# Altium schematic sheet Type-C_Connector_and_PD_Switch.SchDoc: Type-C Connector & PD Switch
size 292 x 193 mm; SheetNumber: 4; SheetTotal: 12; SheetSize: A4
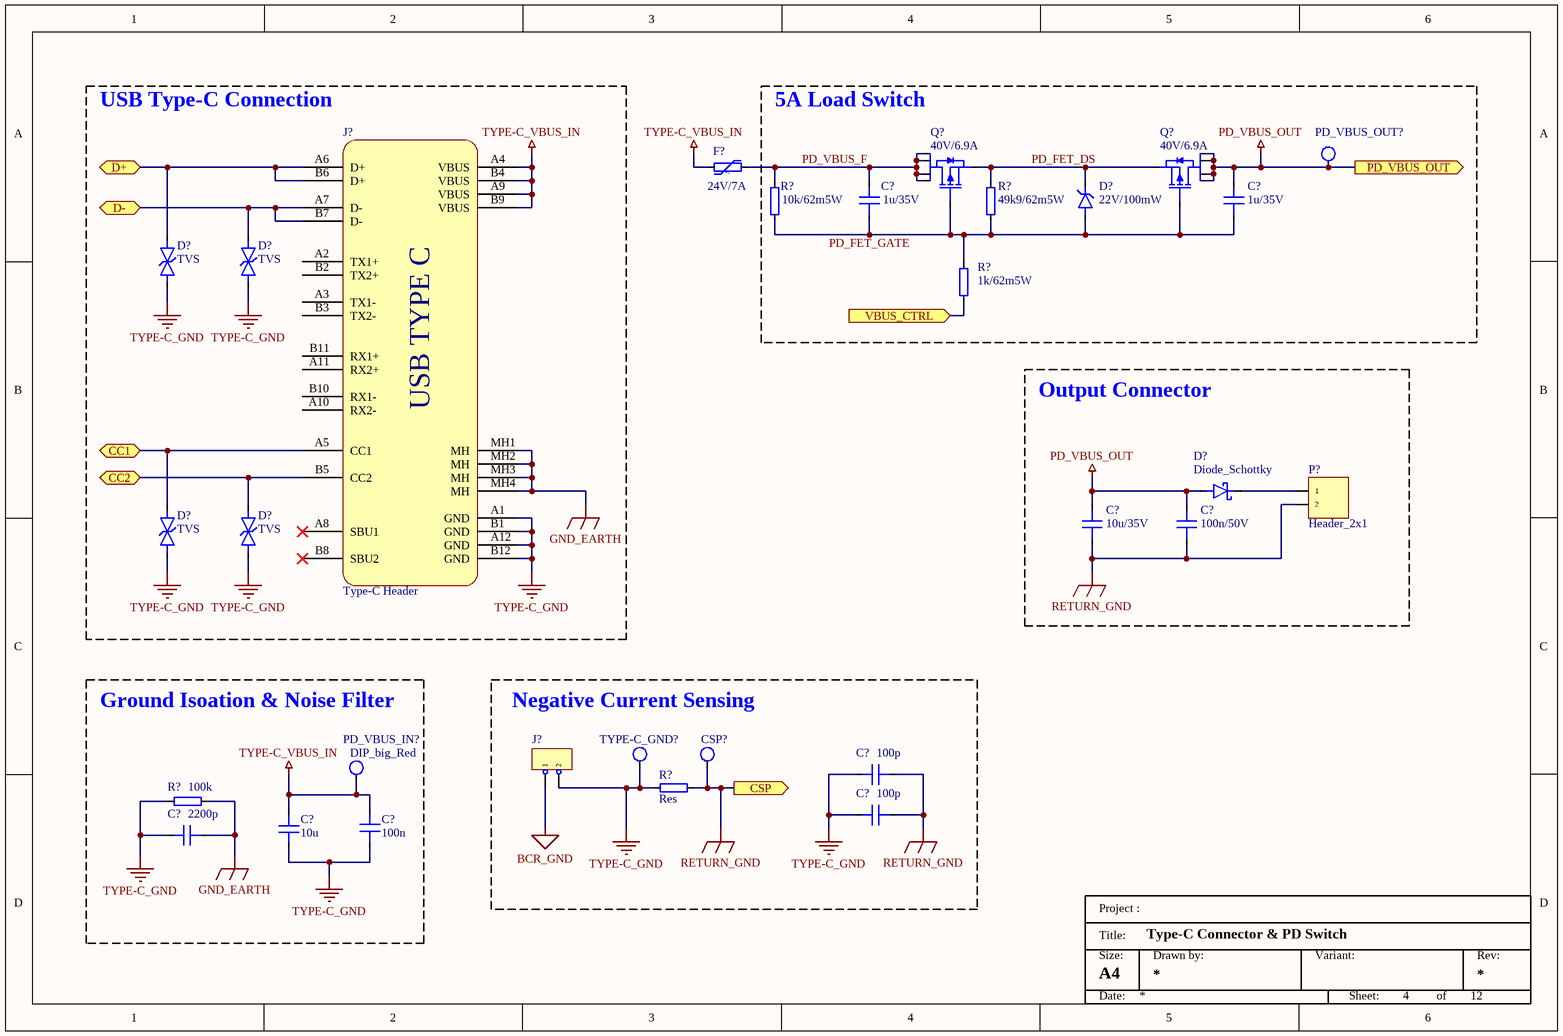
[diagram p0: Type-C_Connector_and_PD_Switch.SchDoc]

## Parts
(Parts that share a designator on the sheet are numbered #1, #2 ... from top to bottom, then left to right.)
C?#1  1u/35V  [0805_Cap]
C?#2  1u/35V  [0805_Cap]
C?#3  10u/35V  [0805_Cap]
C?#4  100n/50V  [0402_CAP]
C?#5  100p  [0805_Cap]
C?#6  100p  [0805_Cap]
C?#7  100n  [0805_Cap]
C?#8  2200p  [0805_Cap]
C?#9  10u  [0805_Cap]
CSP?  SMD_25mil  [TestPoint_smd_25mil]  (value not drawn)
D?#1  22V/100mW  [SOD-923-2]
D?#2  TVS  [SOD-523]
D?#3  TVS  [SOD-523]
D?#4  Diode_Schottky
D?#5  TVS  [SOD-523]
D?#6  TVS  [SOD-523]
F?  24V/7A  [2920_PTC]
J?#1  Type-C Header
J?#2  Jumper_2x1  [Dupont_Header_(Female)_2.54_2x1]  (value not drawn)
P?  Header_2x1  [XT60PW-M]
PD_VBUS_IN?  DIP_big_Red  [TestPoint_dip_big]
PD_VBUS_OUT?  DIP_big_Red  [TestPoint_dip_big]  (value not drawn)
Q?#1  40V/6.9A  [TSOP-6]
Q?#2  40V/6.9A  [TSOP-6]
R?#1  10k/62m5W  [0402_Res]
R?#2  49k9/62m5W  [0402_Res]
R?#3  1k/62m5W  [0402_Res]
R?#4  Res  [0603_Res]
R?#5  100k  [0603_Res]
TYPE-C_GND?  SMD_25mil  [TestPoint_smd_25mil]  (value not drawn)

## Blocks framed on the sheet
USB Type-C Connection: D?#2 D?#3 D?#5 D?#6 J?#1
5A Load Switch: C?#1 C?#2 D?#1 PD_VBUS_OUT? Q?#1 Q?#2 R?#1-R?#3
Output Connector: C?#3 C?#4 D?#4 P?
Ground Isoation & Noise Filter: C?#7-C?#9 PD_VBUS_IN? R?#5
Negative Current Sensing: C?#5 C?#6 CSP? J?#2 R?#4 TYPE-C_GND?

## Ports
CC1 (bidir), CC2 (bidir), CSP (out), D+ (bidir), D- (bidir), PD_VBUS_OUT (out), VBUS_CTRL (in)

## Nets
BCR_GND: J?#2.1
GND_EARTH: C?#8.2 J?#1.MH1(MH) J?#1.MH2(MH) J?#1.MH3(MH) J?#1.MH4(MH) R?#5.2
PD_VBUS_OUT: C?#2.1 C?#3.1 C?#4.1 D?#4.1(A) PD_VBUS_OUT?.1 Q?#2.1(D1_1) Q?#2.2(D1_2) Q?#2.5(D1_3) Q?#2.6(D1_4) ; port PD_VBUS_OUT
RETURN_GND: C?#3.2 C?#4.2 C?#5.2 C?#6.2 CSP?.1 P?.2 R?#4.2 ; port CSP
TYPE-C_GND: C?#5.1 C?#6.1 C?#7.2 C?#8.1 C?#9.1 D?#2.2(K) D?#3.1(A) D?#5.2(K) D?#6.2(K) J?#1.A1(GND) J?#1.A12(GND) J?#1.B1(GND) J?#1.B12(GND) J?#2.2 R?#4.1 R?#5.1 TYPE-C_GND?.1
TYPE-C_VBUS_IN: C?#7.1 C?#9.2 F?.1 J?#1.A4(VBUS) J?#1.A9(VBUS) J?#1.B4(VBUS) J?#1.B9(VBUS) PD_VBUS_IN?.1
CC1: D?#5.1(A) J?#1.A5(CC1) ; port CC1
CC2: D?#6.1(A) J?#1.B5(CC2) ; port CC2
D+: D?#2.1(A) J?#1.A6(D+) J?#1.B6(D+) ; port D+
D-: D?#3.2(K) J?#1.A7(D-) J?#1.B7(D-) ; port D-
PD_FET_DS: D?#1.2(K) Q?#1.4(S1) Q?#2.4(S1) R?#2.2
PD_FET_GATE: C?#1.2 C?#2.2 D?#1.1(A) Q?#1.3(G1) Q?#2.3(G1) R?#1.2 R?#2.1 R?#3.2
PD_VBUS_F: C?#1.1 F?.2 Q?#1.1(D1_1) Q?#1.2(D1_2) Q?#1.5(D1_3) Q?#1.6(D1_4) R?#1.1
VBUS_CTRL: R?#3.1 ; port VBUS_CTRL
NetD?#4_2: D?#4.2(K) P?.1

Not connected (* = marked no-connect by the designer): J?#1 A2(TX1+) A3(TX1-) A8(SBU1)* A10(RX2-) A11(RX2+) B2(TX2+) B3(TX2-) B8(SBU2)* B10(RX1-) B11(RX1+)

## Notes on the sheet
- Project :
- Size:
- Title:
- Drawn by:
- Variant:
- Rev:
- Date:
- Sheet:
- of
- (in symbol PTC) +t°
- (in symbol Type-C_20_Female) USB TYPE C

## Library data of the parts
C?#1 C?#2 = Cap: 25V 1uF Y5V ±20% 0805  Multilayer Ceramic Capacitors MLCC - SMD/SMT ROHS; Mfr. #: 0805F105M250NT; Mfr.: FH (Guangdong Fenghua Advanced Tech); Datasheet: https://datasheet.lcsc.com/lcsc/1810311214_FH--Guangdong-Fenghua-Advanced-Tech-0805F105M250NT_C89378.pdf; Distributor_Link: https://jlcpcb.com/partdetail/90558-0805F105M250NT/C89378; Distributor #: C89378
C?#3 = Cap: 25V 10uF X5R - Multilayer Ceramic Capacitors MLCC - SMD/SMT ROHS; Mfr. #: GRM21BR61E106KA73K; Mfr.: Murata Electronics; Datasheet: https://jlcpcb.com/parts/2nd/Capacitors/Multilayer_Ceramic_Capacitors_MLCC_SMD_SMT_33; Distributor_Link: https://jlcpcb.com/partdetail/4477883-GRM21BR61E106KA73K/C3909351; Distributor #: C3909351
C?#4 = Cap: 16V 100nF -20%~+80% 0402  Multilayer Ceramic Capacitors MLCC - SMD/SMT ROHS; Mfr. #: 0402F104Z160NT; Mfr.: FH (Guangdong Fenghua Advanced Tech); Datasheet: https://datasheet.lcsc.com/lcsc/2202131930_FH--Guangdong-Fenghua-Advanced-Tech-0402F104Z160NT_C2838746.pdf; Distributor_Link: https://jlcpcb.com/partdetail/3013916-0402F104Z160NT/C2838746; Distributor #: C2838746
C?#5-C?#9 = Cap: General capacitor (non-polarized); Mfr. #: *; Mfr.: *; Distributor_Link: *; Datasheet: *; Distributor #: *
CSP? PD_VBUS_IN? PD_VBUS_OUT? TYPE-C_GND? = Test_Point: General test point; Mfr. #: N/A; Mfr.: N/A; Distributor_Link: N/A; Datasheet: N/A; Distributor #: N/A
D?#1 = Diode_Zener: Zener Diodes CDZV22B is the 100mW type compact (1006 size) diode for voltage regulation.; Mfr. #: CDZVT2R22B; Mfr.: ROHM Semiconductor; Distributor_Link: https://www.mouser.tw/ProductDetail/ROHM-Semiconductor/CDZVT2R22B?qs=4v%252BiZTmLVHG6BDwFzUsoYg%3D%3D; Datasheet: https://www.rohm.com/datasheet?p=CDZV22B&dist=Mouser&media=referral&source=mouser.com&campaign=Mouser; Distributor #: 755-CDZVT2R22B
D?#2 D?#3 D?#5 D?#6 = TVS: General TVS; Mfr. #: *; Mfr.: *; Distributor_Link: *; Datasheet: *; Distributor #: *
D?#4 = Diode_Schottky: General schottky diode; Mfr. #: *; Mfr.: *; Distributor_Link: *; Datasheet: *; Distributor #: *
F? = PTC: Resettable Fuses - PPTC PTC SMD RESETTABLE FUSE; Mfr. #: 2920L700/24SLER; Mfr.: Littelfuse; Distributor_Link: https://www.mouser.tw/ProductDetail/Littelfuse/2920L700-24SLER?qs=7MVldsJ5UazQEVth1QGslQ%3D%3D; Datasheet: https://www.mouser.tw/datasheet/2/240/littelfuse_ptc_low_rho_datasheet_pdf-2956203.pdf; Distributor #: 576-2920L700/24SLER
J?#1 = Type-C_20_Female: Gerenal Type-C female header; MFR. #: *; Mfr.: *; Distributor_Link: *; Datasheet: *; Distributor #: *
J?#2 = Jumper_2x1: General Jumper 2x1; Mfr. #: *; Mfr.: *; Distributor_Link: *; Datasheet: *; Distributor #: *
P? = Header_2x1: General header 2x1; Mfr. #: *; Mfr.: *; Distributor_Link: *; Datasheet: *; Distributor #: *
Q?#1 Q?#2 = MOSFET_P_1: MOSFET P Ch -40Vds 20Vgs AEC-Q101 Qualified; Mfr. #: SQ3419EV-T1_GE3; Mfr.: Vishay Semiconductors; Distributor_Link: https://www.mouser.tw/ProductDetail/Vishay-Semiconductors/SQ3419EV-T1_GE3?qs=Vcr9%2FL0R50hjQdrP75bU0Q%3D%3D&gclid=CjwKCAjwg-GjBhBnEiwAMUvNW2_QHlpdOmMyQk5t1a0eb3FLtCoKgaDvyU_lKGTsS4lC8mEsJurJAhoCUjcQAvD_BwE; Datasheet: https://www.vishay.com/doc?68210; Distributor #: 78-SQ3419EV-T1_GE3
R?#1 = Res: 62.5mW Thick Film Resistors ±100ppm/℃ ±5% 10kΩ 0402  Chip Resistor - Surface Mount ROHS; Mfr. #: CR-02JA6---10K; Mfr.: Viking Tech; Distributor_Link: https://jlcpcb.com/partdetail/VikingTech-CR_02JA6_10K/C2924170; Datasheet: https://datasheet.lcsc.com/lcsc/2111241930_Viking-Tech-CR-02JA6---10K_C2924170.pdf; Distributor #: C2924170
R?#2 = Res: 62.5mW Thick Film Resistors ±1% 49.9kΩ 0402  Chip Resistor - Surface Mount ROHS; Mfr. #: CR0402FF4992G; Mfr.: LIZ Elec; Distributor_Link: https://jlcpcb.com/partdetail/LizElec-CR0402FF4992G/C100457; Datasheet: https://datasheet.lcsc.com/lcsc/1810170232_LIZ-Elec-CR0402FF4992G_C100457.pdf; Distributor #: C100457
R?#3 = Res: 63mW ±5% 1kΩ 0402  Chip Resistor - Surface Mount ROHS; Mfr. #: CR0402J1K00Q10Z; Mfr.: Ever Ohms Tech; Distributor_Link: https://jlcpcb.com/partdetail/Ever_OhmsTech-CR0402J1K00Q10Z/C881213; Datasheet: https://datasheet.lcsc.com/lcsc/2010191904_Ever-Ohms-Tech-CR0402J1K00Q10Z_C881213.pdf; Distributor #: C881213
R?#4 R?#5 = Res: General Resistor; Mfr. #: *; Mfr.: *; Distributor_Link: *; Datasheet: *; Distributor #: *